# EAGLE design ATSAME51G19A_CAN_BREAKOUT (EAGLE 7.6.0)
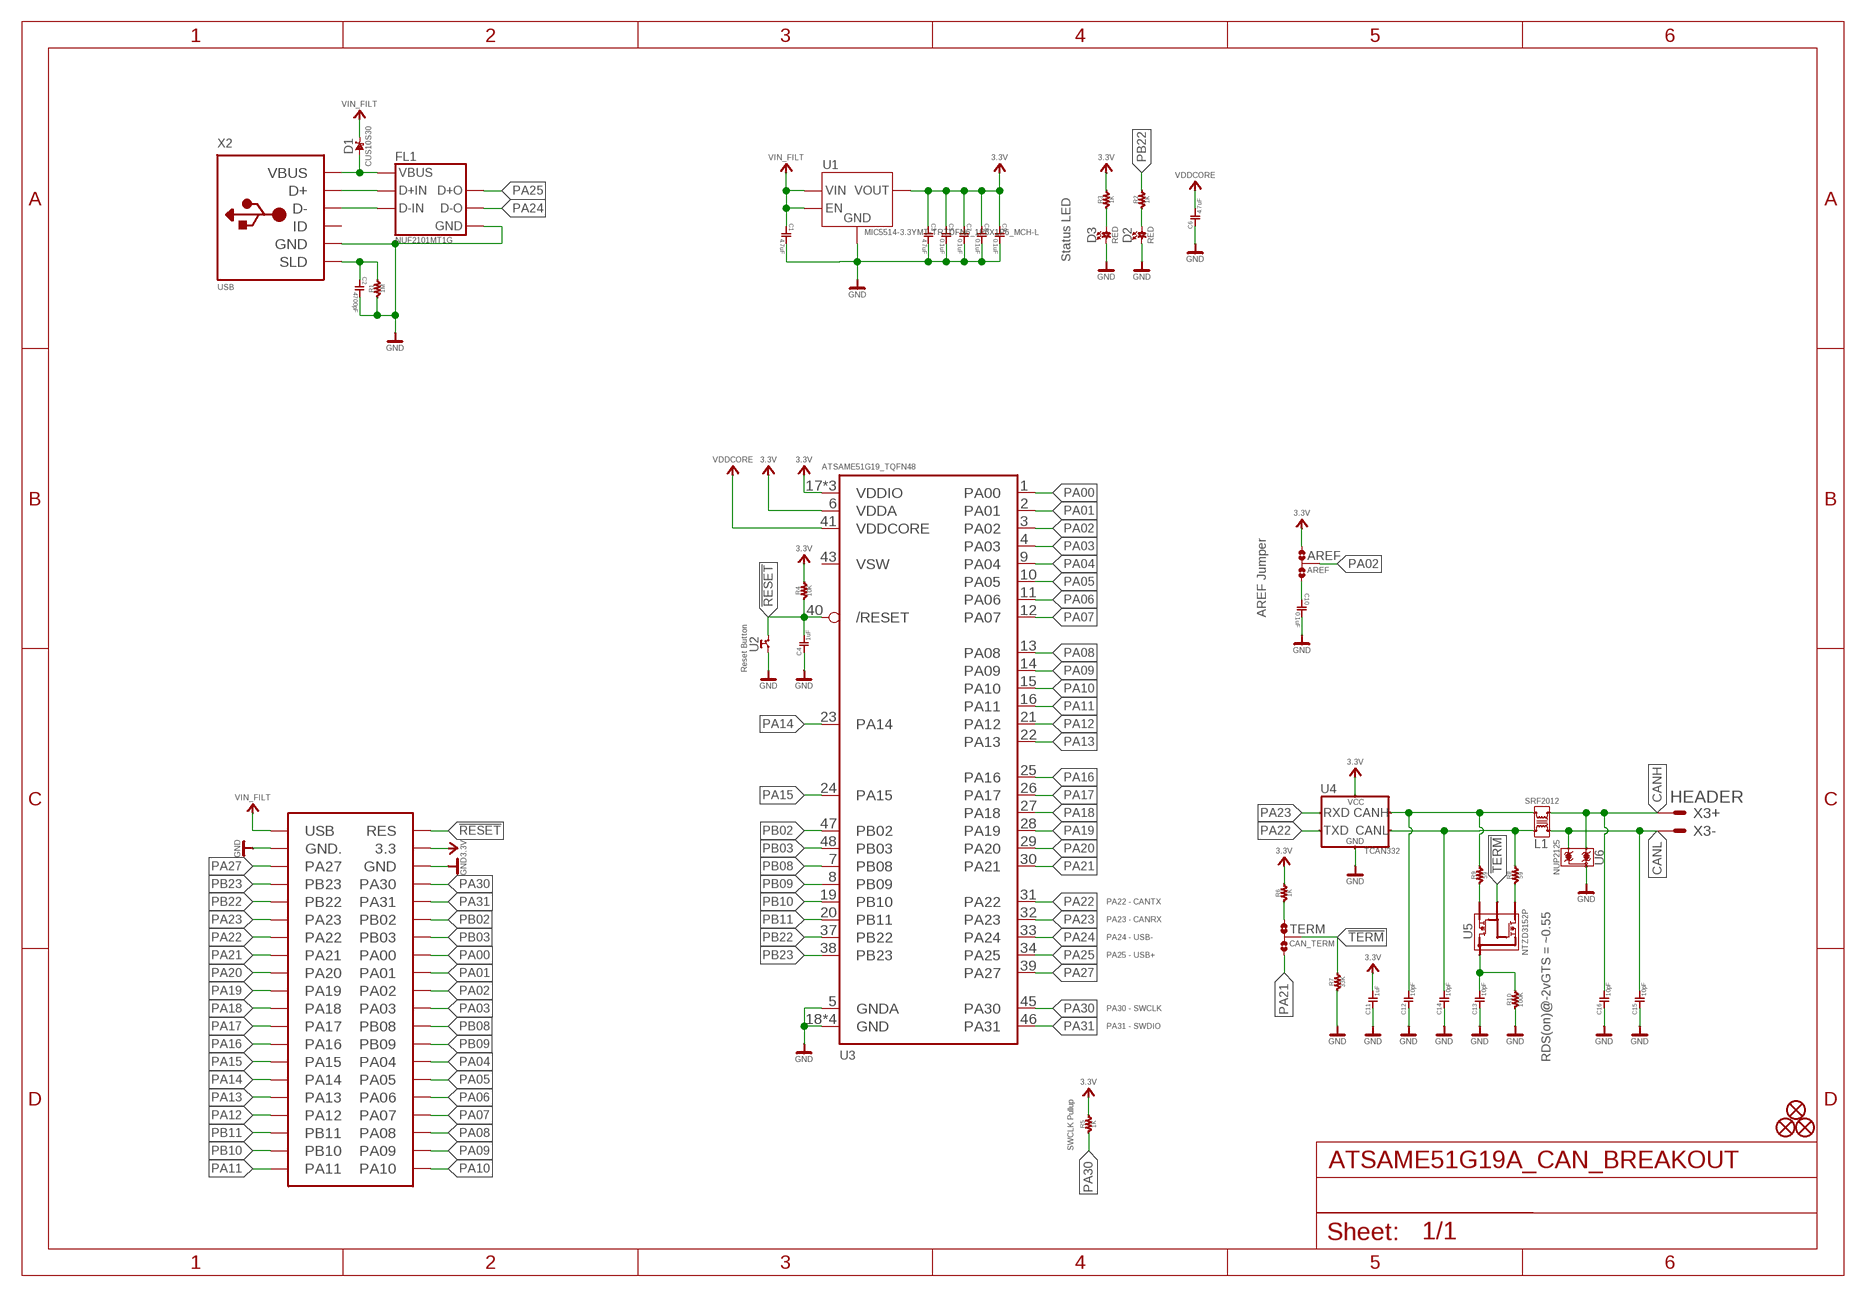
[diagram p0: schematic, sheet 1, part 1 of 2]
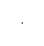
[diagram p1: schematic, sheet 1, part 2 of 2]

## Parts
AREF  AREF  0R-JUMPC  [C0R-JMP]
C1  4.7uF  CAPACITOR0402  [CAP0402]
C2  4700pF  CAPACITOR0402  [CAP0402]
C3  4.7uF  CAPACITOR0402  [CAP0402]
C4  1uF  CAPACITOR0402  [CAP0402]
C5  0.1uF  CAPACITOR0402  [CAP0402]
C6  4.7uF  CAPACITOR0402  [CAP0402]
C7  0.1uF  CAPACITOR0402  [CAP0402]
C8  0.1uF  CAPACITOR0402  [CAP0402]
C9  0.1uF  CAPACITOR0402  [CAP0402]
C10  0.1uF  CAPACITOR0402  [CAP0402]
C11  1uF  CAPACITOR0402  [CAP0402]
C12  10pF  CAPACITOR0402  [CAP0402]
C13  10pF  CAPACITOR0402  [CAP0402]
C14  10pF  CAPACITOR0402  [CAP0402]
C15  10pF  CAPACITOR0402  [CAP0402]
C16  10pF  CAPACITOR0402  [CAP0402]
D1  CUS10S30  SCHOTTKYX3-WLB1608-2  [X3-WLB1608-2]
D2  0603 LED  LED-SMD0603  [LED-0603]
D3  0603 LED  LED-SMD0603  [LED-0603]
FID1  MICROBUILDER_FIDUCIAL_0.5MM  [MICROBUILDER_FIDUCIAL_0.5MM]
FID2  MICROBUILDER_FIDUCIAL_0.5MM  [MICROBUILDER_FIDUCIAL_0.5MM]
FID3  MICROBUILDER_FIDUCIAL_0.5MM  [MICROBUILDER_FIDUCIAL_0.5MM]
FL1  NUF2101MT1G  [SOT95P275X110-6N]
L1  SRF2012  SRF2012AA  [SRF2012AA]
R1  1M  RESISTOR0402  [RES0402]
R2  1K  RESISTOR0402  [RES0402]
R3  1K  RESISTOR0402  [RES0402]
R4  10K  RESISTOR0402  [RES0402]
R5  1K  RESISTOR0402  [RES0402]
R6  1K  RESISTOR0402  [RES0402]
R7  33K  RESISTOR0402  [RES0402]
R8  59  RESISTOR0603  [RES0603]
R9  59  RESISTOR0603  [RES0603]
R10  100K  RESISTOR0402  [RES0402]
TERM  CAN_TERM  0R-JUMPC  [C0R-JMP]
U1  MIC5514-3.3YMT-TRTDFN6_1P6X1P6_MCH-L  [TDFN6_1P6X1P6_MCH-L]
U2  PUSH_SWITCHPTS815  [SWITCH_PTS815]
U3  ATSAME51G19_TQFN48  [TQFN48_7MM]
U4  TCAN332  [DCN0008A]
U5  NTZD3152P  PMOS_ARRAY_CANTNTZD3152P  [SOT-563]
U6  NUP2125  [SC70]
X1  CONN  SAME-BOARD  [BOARDOUTLINE]
X2  USB  [10118194]
X3  HEADER  22-23-2021  [22-23-2021]

## Nets
3.3V: AREF.1 C3.1(C1) C5.1(C1) C7.1(C1) C8.1(C1) C9.1(C1) C11.2(C2) R3.2 R4.2 R5.2 R6.2 U1.4(VOUT) U1.5(VOUT) U3.6(VDDA) U3.17(VDDIO) U3.36(VDDIO) U3.44(VDDIO) U4.3(VCC) X1.3.3
!RESET: C4.2(C2) R4.1 U2.P$3 U2.P$4 U3.40(/RESET) X1.!RES(RES)
!TERM: R7.2 TERM.2 U5.P$2(GATE) U5.P$5(GATE)
CANH: C16.2(C2) L1.4 U6.1 X3.1
CANL: C15.2(C2) L1.1 U6.2 X3.2
GND: C1.2(C2) C2.2(C2) C3.2(C2) C4.1(C1) C5.2(C2) C6.1(C1) C7.2(C2) C8.2(C2) C9.2(C2) C10.2(C2) C11.1(C1) C12.1(C1) C13.1(C1) C14.1(C1) C15.1(C1) C16.1(C1) D2.C D3.C FL1.2(GND) R1.1 R7.1 R10.1 U1.6(GND) U1.7(GND) U2.P$1 U2.P$2 U3.5(GNDA) U3.18(GND) U3.35(GND) U3.42(GND) U3.THERMAL(GND) U4.2(GND) U6.3 X1.GND X1.GND. X2.5(GND)
N$1: C13.2(C2) R10.2 U5.P$4(DRAIN1) U5.P$6(DRAIN1)
N$2: R8.1 U5.P$3(DRAIN2)
N$3: D3.A R3.1
N$4: FL1.6(D+I) X2.3(D+)
N$5: D2.A R2.1
N$6: FL1.4(D-_I) X2.2(D-)
N$7: R6.1 TERM.1
N$8: C2.1(C1) R1.2 X2.GND4(SLD) X2.GND5(SLD) X2.P$1(SLD) X2.P$2(SLD) X2.P$3(SLD) X2.P$4(SLD)
N$9: AREF.3 C10.1(C1)
N$18: C14.2(C2) L1.2 R8.2 U4.6(CANL)
N$21: R9.1 U5.P$1(SOURCE1)
N$23: C12.2(C2) L1.3 R9.2 U4.7(CANH)
PA00: U3.1(PA00) X1.PA00
PA01: U3.2(PA01) X1.PA01
PA02: AREF.2 U3.3(PA02) X1.PA02
PA03: U3.4(PA03) X1.PA03
PA04: U3.9(PA04) X1.PA04
PA05: U3.10(PA05) X1.PA05
PA06: U3.11(PA06) X1.PA06
PA07: U3.12(PA07) X1.PA07
PA08: U3.13(PA08) X1.PA08
PA09: U3.14(PA09) X1.PA09
PA10: U3.15(PA10) X1.PA10
PA11: U3.16(PA11) X1.PA11
PA12: U3.21(PA12) X1.PA12
PA13: U3.22(PA13) X1.PA13
PA14: U3.23(PA14) X1.PA14
PA15: U3.24(PA15) X1.PA15
PA16: U3.25(PA16) X1.PA16
PA17: U3.26(PA17) X1.PA17
PA18: U3.27(PA18) X1.PA18
PA19: U3.28(PA19) X1.PA19
PA20: U3.29(PA20) X1.PA20
PA21: TERM.3 U3.30(PA21) X1.PA21
PA22: U3.31(PA22) U4.1(TXD) X1.PA22
PA23: U3.32(PA23) U4.4(RXD) X1.PA23
PA24 [can]: FL1.3(D-_O) U3.33(PA24)
PA25 [can]: FL1.1(D+_O) U3.34(PA25)
PA27: U3.39(PA27) X1.PA27
PA30: R5.1 U3.45(PA30) X1.PA30
PA31: U3.46(PA31) X1.PA31
PB02: U3.47(PB02) X1.PB02
PB03: U3.48(PB03) X1.PB03
PB08: U3.7(PB08) X1.PB08
PB09: U3.8(PB09) X1.PB09
PB10: U3.19(PB10) X1.PB10
PB11: U3.20(PB11) X1.PB11
PB22: R2.2 U3.37(PB22) X1.PB22
PB23: U3.38(PB23) X1.PB23
VBUS: D1.ANNODE FL1.5(VBUS) X2.1(VBUS)
VDDCORE: C6.2(C2) U3.41(VDDCORE)
VIN_FILT: C1.1(C1) D1.CATHODE U1.1(EN) U1.2(EN) U1.3(VIN) X1.USB
Unconnected: U3.43(VSW) X2.4(ID)

## Notes on the sheet
- Status LED
- AREF Jumper
- Reset Button
- PA22 - CANTX
- PA23 - CANRX
- PA24 - USB-
- PA25 - USB+
- PA30 - SWCLK
- PA31 - SWDIO
- RDS(on)@-2vGTS = ~0.55
- SWCLK Pullup

## Library data of the parts
AREF TERM = MyLibrary:0R-JUMP: SMD 0R 0805 Jumper
C1 = MyLibrary:CAPACITOR: Ceramic Capacitors; MPN: CL05A106MP8NUB8; VOLTAGE: 10V
C2 = MyLibrary:CAPACITOR: Ceramic Capacitors; MPN: CC0402KRX7R8BB472; VOLTAGE: 25V
C3 C6 = MyLibrary:CAPACITOR: Ceramic Capacitors; MPN: GRM155R60J106ME05D; VOLTAGE: 6.3V
C4 C5 C7-C11 = MyLibrary:CAPACITOR: Ceramic Capacitors; MPN: CL05A105KQ5NNNC; VOLTAGE: 6.3V
C12-C16 = MyLibrary:CAPACITOR: Ceramic Capacitors; MPN: C0402C100K5RAC7867; VOLTAGE: 50V
D1 = MyLibrary:SCHOTTKY; MPN: SDM2U30CSP-7
D2 D3 = MyLibrary:LED-SMD: Red SMD LED Used in manufacturing of most products at SparkFun Packages: 0603 - SMD 0603 package [Product Link] <http://docs.avagotech.com/docs/AV02-0551EN> 0603 SMART - SMD 0603 SMART package ( more efficient and expensive)[Product Link] <http://www.osram-os.com/Graphics/XPic2/00077099_0.pdf> 1206 - SMD1206 package [Product Link] <https://www.sparkfun.com/datasheets/DevTools/LilyPad/Q150OVS4.pdff> SparkFun Products: Pro Mini 328 -5V <https://www.sparkfun.com/products/821> RedBoard <https://www.sparkfun.com/products/12757> IOIO-OTG <https://www.sparkfun.com/products/13613>; COLOR: RED; MPN: LNJ8W0C83RA
FID1-FID3 = Adafruit ItsyBitsy M4:MICROBUILDER_FIDUCIAL: Fiducial Alignment Points Various fiducial points for machine vision alignment.
FL1 = NUF2101MT1G:NUF2101MT1G: ON Semiconductor ESD Protection Diode 3.1mm Length,, 5.25 V, 225 mW Source: Datasheet <https://componentsearchengine.com/Datasheets/2/NUF2101MT1G.pdf>; ARROW_PART_NUMBER: NUF2101MT1G; ARROW_PRICE-STOCK: https://www.arrow.com/en/products/nuf2101mt1g/on-semiconductor; DESCRIPTION: ON Semiconductor ESD Protection Diode 3.1mm Length,, 5.25 V, 225 mW; HEIGHT: 1.1mm; MANUFACTURER_NAME: ON Semiconductor; MANUFACTURER_PART_NUMBER: NUF2101MT1G; MOUSER_PART_NUMBER: 863-NUF2101MT1G; MOUSER_PRICE-STOCK: https://www.mouser.co.uk/ProductDetail/ON-Semiconductor/NUF2101MT1G?qs=ZXBb0xZ9WeCMS4KEHrDDVQ%3D%3D
L1 = MyLibrary:SRF2012AA; MPN: SRF2012-121YA
R1 = MyLibrary:RESISTOR; MPN: PFR05S-105-FNH; TOLERANCE: 1%; WATTAGE: 1/16W
R2-R4 = MyLibrary:RESISTOR; MPN: CR0402-FX-1002GLF; TOLERANCE: 1%; WATTAGE: 1/16W
R5 R6 = MyLibrary:RESISTOR; MPN: PFR05S-102-FNH; TOLERANCE: 1%; WATTAGE: 1/16W
R7 = MyLibrary:RESISTOR; MPN: RMCF0402FT33K0; TOLERANCE: 1%; WATTAGE: 1/16W
R8 R9 = MyLibrary:RESISTOR; MPN: CRCW060359R0FKEAHP; TOLERANCE: 1%; WATTAGE: 1/3W
R10 = MyLibrary:RESISTOR; MPN: CR0402-FX-1003GLF; TOLERANCE: 1%; WATTAGE: 1/16W
U1 = MyLibrary:MIC5514-3.3YMT-TR; BUILT_BY: EMA_Jessica; COPYRIGHT: Copyright (C) 2018 Accelerated Designs. All rights reserved; MANUFACTURER_PART_NUMBER: MIC5514-3.3YMT-TR; SOURCELIBRARY: Microchip_2019-08-23_18; VENDOR: Microchip
U2 = MyLibrary:PUSH_SWITCH; MPN: PTS815 SJM 250 SMTR LFS
U3 = MyLibrary:ATSAME51G19; MPN: ATSAME51G19A-MF
U4 = MyLibrary:TCAN332; MPN: TCAN332DCNR
U5 = MyLibrary:PMOS_ARRAY_CANT; MPN: NTZD3152PT1G
U6 = MyLibrary:NUP2125; MPN: NUP2125WTT1G
X1 = MyLibrary:SAME-BOARD
X2 = MyLibrary:USB; MPN: 10118194-0001LF
X3 = con-molex:22-23-2021: .100" (2.54mm) Center Header - 2 Pin; MF: MOLEX; MPN: 22-23-2021; OC_FARNELL: 1462926; OC_NEWARK: 25C3832

## Net classes
0 default: width 0.152 mm, drill 0.254 mm, clearance 0.152 mm
1 can: width 0.152 mm, drill 0.254 mm, clearance 0.152 mm

## Board
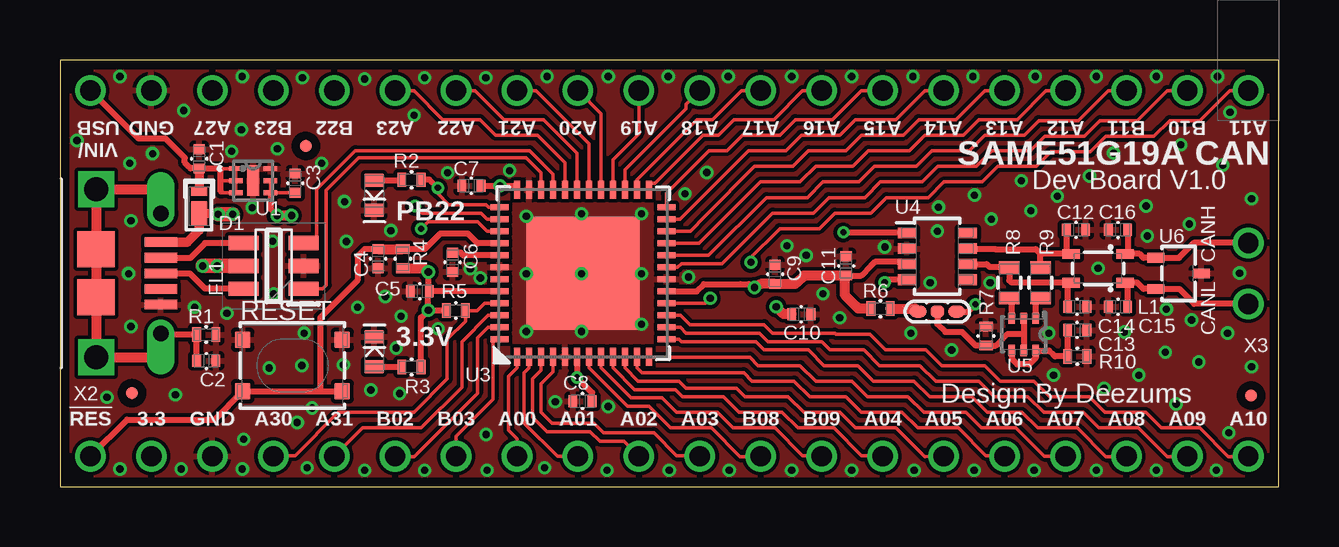
[diagram p2: board, top side]
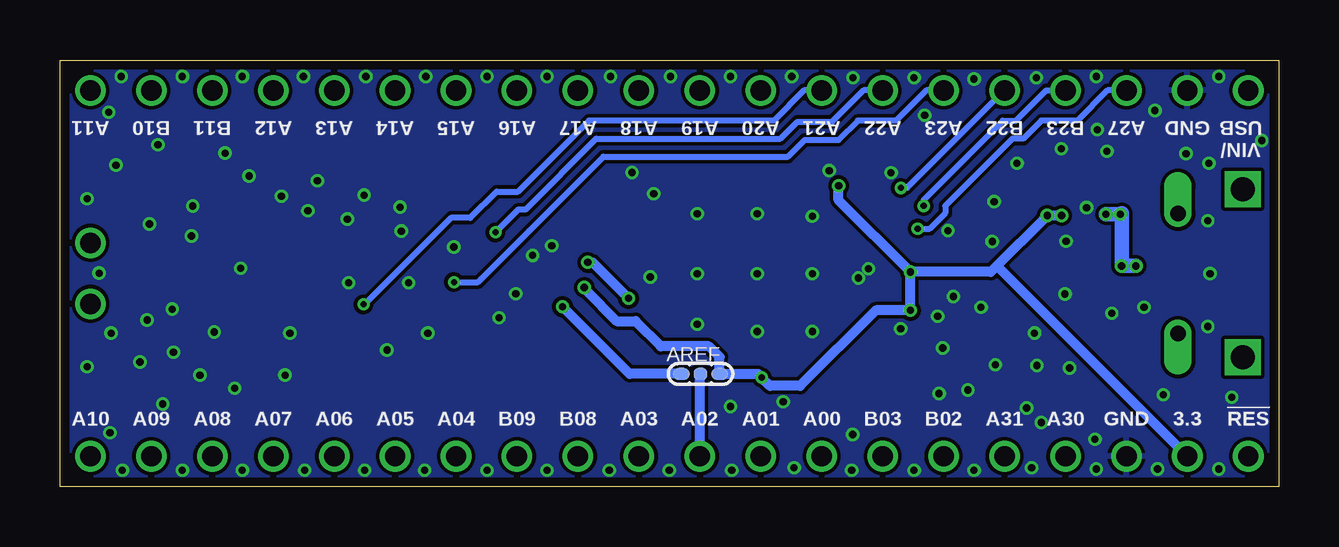
[diagram p3: board, bottom side, seen from below]

Size 50.8 x 17.78 mm. Coordinates in mm from the lower left corner, seen from the top.
Copper layers (1*16): Top 0.035559375mm / dielectric 1.6mm / Bottom 0.035559375mm
Design rules "oshpark-2layer *": minimum track width 6mil, minimum drill 10mil, track to track 6mil, track to pad 6mil, pad to pad 6mil, via to via 6mil, smd to smd 6mil, copper to edge 15mil, drill to drill 6mil, minimum pad ring 5mil, minimum via ring 5mil, stop-mask expansion 0.01mm, vias tented up to drill 0.3mm, thermal gap 6mil

### Footprints (pad centres in the part's own frame; a part is rotated, then mirrored left to right if it is on the bottom)
C0R-JMP = smd 0.5 x 0.7: 1 0,0.8; 3 0,-0.8 | smd 0.5 x 0.559: 2 0,0
CAP0402 = smd 0.4 x 0.5: 1 -0.4,0; 2 0.4,0
X3-WLB1608-2 = smd 1.035 x 0.69: ANNODE 0.293,0 | smd 0.385 x 0.69: CATHODE -0.619,0
LED-0603 = smd 0.55 x 0.8: A -0.625,0; C 0.625,0
MICROBUILDER_FIDUCIAL_0.5MM = smd 0.5 x 0.5: 1 0,0
SOT95P275X110-6N = smd 1.25 x 0.6: 1 -1.25,0.95; 2 -1.25,0; 3 -1.25,-0.95; 4 1.25,-0.95; 5 1.25,0; 6 1.25,0.95
SRF2012AA = smd 0.75 x 0.4: 1 -1.125,0.6; 2 1.125,0.6; 3 1.125,-0.6; 4 -1.125,-0.6
RES0402 = smd 0.4 x 0.6: 1 -0.4,0; 2 0.4,0
RES0603 = smd 0.5 x 0.9: 1 -0.65,0; 2 0.65,0
TDFN6_1P6X1P6_MCH-L = smd 0.559 x 0.203: 1 -0.724,0.508; 2 -0.724,0; 3 -0.724,-0.508; 4 0.724,-0.508; 5 0.724,0; 6 0.724,0.508 | smd 0.508 x 1.27: 7 0,0
SWITCH_PTS815 = smd 0.65 x 0.7: P$1 -2.075,1.075; P$2 2.075,1.075; P$3 -2.075,-1.075; P$4 2.075,-1.075
TQFN48_7MM = smd 0.25 x 0.75: 1 -2.75,-3.475; 2 -2.25,-3.475; 3 -1.75,-3.475; 4 -1.25,-3.475; 5 -0.75,-3.475; 6 -0.25,-3.475; 7 0.25,-3.475; 8 0.75,-3.475; 9 1.25,-3.475; 10 1.75,-3.475; 11 2.25,-3.475; 12 2.75,-3.475; 25 2.75,3.475; 26 2.25,3.475; 27 1.75,3.475; 28 1.25,3.475; 29 0.75,3.475; 30 0.25,3.475; 31 -0.25,3.475; 32 -0.75,3.475; 33 -1.25,3.475; 34 -1.75,3.475; 35 -2.25,3.475; 36 -2.75,3.475 | smd 0.75 x 0.25: 13 3.475,-2.75; 14 3.475,-2.25; 15 3.475,-1.75; 16 3.475,-1.25; 17 3.475,-0.75; 18 3.475,-0.25; 19 3.475,0.25; 20 3.475,0.75; 21 3.475,1.25; 22 3.475,1.75; 23 3.475,2.25; 24 3.475,2.75; 37 -3.475,2.75; 38 -3.475,2.25; 39 -3.475,1.75; 40 -3.475,1.25; 41 -3.475,0.75; 42 -3.475,0.25; 43 -3.475,-0.25; 44 -3.475,-0.75; 45 -3.475,-1.25; 46 -3.475,-1.75; 47 -3.475,-2.25; 48 -3.475,-2.75 | smd 4.7 x 4.7: THERMAL 0,0
DCN0008A = smd 0.8 x 0.45: 1 -1.275,0.975; 2 -1.275,0.325; 3 -1.275,-0.325; 4 -1.275,-0.975; 5 1.275,-0.975; 6 1.275,-0.325; 7 1.275,0.325; 8 1.275,0.975
SOT-563 = smd 0.3 x 0.45: P$1 -0.5,-0.675; P$2 0,-0.675; P$3 0.5,-0.675; P$4 0.5,0.675; P$5 0,0.675; P$6 -0.5,0.675
SC70 = smd 0.4 x 0.75: 1 0.65,0.95; 2 -0.65,0.95; 3 0,-0.95
BOARDOUTLINE = drill 0.85 pad 1.2: 3.3 3.81,1.27; !RES 1.27,1.27; GND 6.35,1.27; GND. 3.81,16.51; PA00 19.05,1.27; PA01 21.59,1.27; PA02 24.13,1.27; PA03 26.67,1.27; PA04 34.29,1.27; PA05 36.83,1.27; PA06 39.37,1.27; PA07 41.91,1.27; PA08 44.45,1.27; PA09 46.99,1.27; PA10 49.53,1.27; PA11 49.53,16.51; PA12 41.91,16.51; PA13 39.37,16.51; PA14 36.83,16.51; PA15 34.29,16.51; PA16 31.75,16.51; PA17 29.21,16.51; PA18 26.67,16.51; PA19 24.13,16.51; PA20 21.59,16.51; PA21 19.05,16.51; PA22 16.51,16.51; PA23 13.97,16.51; PA27 6.35,16.51; PA30 8.89,1.27; PA31 11.43,1.27; PB02 13.97,1.27; PB03 16.51,1.27; PB08 29.21,1.27; PB09 31.75,1.27; PB10 46.99,16.51; PB11 44.45,16.51; PB22 11.43,16.51; PB23 8.89,16.51; USB 1.27,16.51
10118194 = smd 1.35 x 0.4: 1 0,1.3; 2 0,0.65; 3 0,0; 4 0,-0.65; 5 0,-1.3 | smd 1.55 x 1.5: GND4 -2.7,1; GND5 -2.7,-1 | drill 1 pad 1.5 square: P$1 -2.7,3.5; P$2 -2.7,-3.5 | drill 0.65 pad 1.15 offset: P$3 0,2.5; P$4 0,-2.5
22-23-2021 = drill 0.85 pad 1.2: 1 -1.27,0; 2 1.27,0

### Placement (x,y rotation side)
AREF  24.1,4.7 270 bottom
C1  5.8,13.66 90 top
C2  6.1,5.24 0 top
C3  9.81,12.65 90 top
C4  13.26,9.5 90 top
C5  15,8.14 180 top
C6  16.36,9.35 90 top
C7  17.15,12.54 180 top
C8  21.78,3.57 180 top
C9  29.81,8.85 90 top
C10  30.9,7.19 0 top
C11  32.77,9.2 270 top
C12  42.35,10.7 180 top
C13  42.4,6.53 180 top
C14  42.4,7.5 180 top
C15  44.1,7.5 0 top
C16  44.1,10.7 0 top
D1  5.8,11.69 270 top
D2  13.1,12.15 270 top
D3  13.1,5.63 90 top
FID1  3,3.9 0 top
FID2  10.25,14.2 0 top
FID3  49.65,3.8 0 top
FL1  8.9,9.2 180 top
L1  43.27,9.1 180 top
R1  6.1,6.34 180 top
R2  14.65,12.79 0 top
R3  14.65,4.99 0 top
R4  14.29,9.5 270 top
R5  16.5,7.34 180 top
R6  34.2,7.42 180 top
R7  38.6,6.28 270 top
R8  39.57,8.5 90 top
R9  40.87,8.5 90 top
R10  42.4,5.43 180 top
TERM  36.57,7.3 90 top
U1  8.05,12.75 0 top
U2  9.69,5.05 0 top
U3  21.8,8.89 0 top
U4  36.57,9.6 0 top
U5  40.17,6.35 180 top
U6  46.62,8.89 90 top
X1  0,0 0 top
X2  4.2,8.89 0 top
X3  49.53,8.89 270 top

### Tracks (layer width: path | path; a pad name or v marks a point on that pad's centre or on a via)
3.3V  (via drill 0.25, 0.3)
  Top 0.152: U1.5 U1.4 C3.1
  Top 0.254: U3.17 26.54,8.14 26.84,8.44 28.35,8.44 28.71,8.44 v28.95,8.3 | U3.44 C5.1 15.35,8.19 v15.35,8.95 | C7.1 v18.34,12.54 19.05,12.54 U3.36 | v15.35,7.35 15.35,8.05 | R5.2 v15.34,7.34 v15.35,7.35 | U3.6 v21.55,4.55 22.18,3.92 C8.1 | C11.2 33.4,8.8 33.8,9.2 33.97,9.37 35,9.37 35.02,9.28 U4.3 | U1.4 8.77,11.58 v9.05,11.3 | 15.4,7.3 v15.35,7.35 | R3.2 15.05,7.05 v15.35,7.35
  Top 0.406: R4.2 15.2,9.1 v15.35,8.95 | v28.95,8.3 29.2,8.45 C9.1 30.65,8.45 30.7,8.5 31,8.8 32.7,8.8 | C11.2 32.7,8.8 | 32.7,8.8 32.7,8 33.2,7.5 33.28,7.42 R6.2 | v9.65,11.3 v9.05,11.3
  Bottom 0.406: v15.35,8.95 v15.35,7.35 16.8,7.35 19.95,4.2 21.2,4.2 v21.55,4.55 21.7,4.7 AREF.1 23.3,5.4 23.32,5.42 23.75,5.85 25.75,5.85 26.8,6.9 27.6,6.9 28.9,8.2 v28.95,8.3 | v15.35,8.95 18.34,11.94 v18.34,12.54 | 11.75,9.2 9.8,11.15 v9.65,11.3 v9.05,11.3 | 11.75,9.2 12,8.95 v15.35,8.95 | X1.3.3 11.74,9.2 11.75,9.2
!RESET
  Top 0.254: U3.40 17.41,10.14 17,10.55 15.85,10.55 15.2,9.9 R4.1 | X1.!RES 2.8,2.8 6.44,2.8 U2.P$3 10.85,3.98 | 10.85,3.98 U2.P$4 | C4.2 12.7,9.9 12.4,9.6 12.4,8.6 10.85,7.05 10.85,3.98
  Top 0.406: C4.2 R4.1
!TERM
  Top 0.254: U5.P$2 40.17,6.35 | 40.17,6.35 U5.P$5 | 40.17,6.35 39.47,6.35 39,5.88 R7.2 38.17,5.88 37.6,6.45 36.9,6.45 36.57,6.78 TERM.2
CANH
  Top 0.254: X3.1 47.26,10.16 47.2,10.1 46.64,9.54 U6.1 45.16,9.54 45,9.7 L1.4 44.5,9.7 C16.2
CANL
  Top 0.254: X3.2 47.28,7.62 47.2,7.7 46.66,8.24 U6.2 45.16,8.24 44.9,8.5 L1.1 44.5,8.5 C15.2
GND  (via drill 0.3)
  other vias: 36.27,8.5 36.57,10.65 17.75,17.04 17.1,9.08 20.2,0.79 22.8,0.69 25.4,0.69 27.9,0.69 30.5,0.69 17.8,0.69 15.2,0.69 12.7,0.69 10.3,0.79 33,0.69 35.6,0.69 38.1,0.69 40.6,0.69 43.2,0.69 45.7,0.69 48.2,0.69 22.85,17.09 25.35,17.09 27.85,17.09 30.5,17.09 33,17.09 35.55,17.09 38.05,17.09 40.65,17.09 43.2,17.09 45.7,17.09 20.3,17.09 15.2,17.04 12.7,16.99 10.1,17.04 7.6,17.09 2.5,17.09 48.25,17.09 7.6,0.74 5.05,0.74 2.5,0.74 26.05,12.21 26.96,13.09 26.2,8.74 31.1,9.64 20.65,3.54 17.52,8.7 14.76,15.48 18.74,13.17 22.85,3.34 35.47,6.4 41.22,6.4 44.97,4.65 41.42,4.65 43.52,4.1 46.52,3.45 48.72,2.25 36.62,11.65 38.12,12.15 40.07,12.75 43.92,13.9 48.77,15.6 46.72,14.25 49.17,8.9 40.47,11.5 30.3,10.04 46.12,7.4 47.17,6.95 48.67,6.4 46.07,5.6 47.47,5.2 49.67,12 47.07,10.95 45.27,11.7 43.27,9.1 41.57,12.1 42.92,12.95 48.47,13.4 16.16,13.08 11.94,10.22 8.01,11.63 13.56,7.93 12.41,7.48 11.81,5.08 12.96,4.03 14.16,3.88 17.76,2.18 2.96,11.08 2.96,6.68 9.89,2.68 5.16,15.68 7.66,1.98 4.81,3.83 8.86,10.23 1.96,3.73 10.08,5.05 14.22,7.1 10.51,3.28 8.72,4.95 2.86,8.88 3.86,13.88 0.71,14.43 2.91,13.48 37.17,5.7 38.77,8.5 34.38,9.99 31.8,8.04 32.5,7.04 38.82,11.15 44.37,6.45 45.32,10.45 19.44,11.27 21.74,11.37 24.24,11.37 24.24,8.87 19.44,8.87 21.74,8.87 19.44,6.47 21.74,6.47 24.24,6.77 7.56,14.88 11.86,11.88 6.96,7.23 14.01,5.78 5.61,7.48 8.91,8.03 10.18,6.4 9.06,14.08 7.16,13.98 15.76,6.58 10.91,13.48 13.79,10.67 49.67,5
  pour Top (rank 6): 0,0 50.8,0 50.8,17.78 0,17.78
  pour Bottom (rank 6): 50.8,0 0,0 0,17.78 50.8,17.78
N$1
  Top 0.254: U5.P$4 39.67,5.33 39.9,5.1 40.4,5.1 40.67,5.37 U5.P$6 41.23,5.68 41.4,5.5 41.47,5.43 R10.2 C13.2
N$2
  Top 0.254: U5.P$3 39.67,7.85 R8.1
N$3
  Top 0.254: D3.A 13.12,4.99 R3.1
N$4
  Top 0.254: X2.3 5.41,8.89 6.05,8.25 FL1.6
N$5
  Top 0.254: D2.A 14.25,12.78 R2.1
N$6
  Top 0.254: X2.2 5.44,9.54 6.05,10.15 FL1.4
N$7
  Top 0.406: R6.1 35.65,7.42 TERM.1
N$8
  Top 0.254: X2.P$4 4.25,6.34 R1.2 C2.1
  Top 0.406: X2.P$4 4.2,5.39 X2.P$2 X2.GND5 X2.GND4 X2.P$1 4.2,12.39 X2.P$3
N$9  (via drill 0.3)
  Top 0.406: C10.1 30.16,7.19 v29.85,7.5
  Bottom 0.406: v29.84,7.5 v29.85,7.5 27.05,4.7 AREF.3
N$18
  Top 0.254: C14.2 42,8.5 L1.2 39.67,8.5 39.57,8.6 R8.2 38.75,9.15 38.62,9.28 U4.6
N$21
  Top 0.254: U5.P$1 40.67,7.85 R9.1
N$23
  Top 0.254: 40.87,9.7 L1.3 41.95,9.7 C12.2 | 40.87,9.7 40.67,9.9 38.97,9.9 37.87,9.9 U4.7 | R9.2 40.87,9.7
PA00
  Top 0.152: U3.1 19.05,4.95 18.7,4.6 18.7,2.35 19.05,2 X1.PA00
PA01
  Top 0.152: U3.2 19.55,4.95 19.35,4.75 19.35,2.65 20.73,1.27 X1.PA01
PA02
  Top 0.152: U3.3 20.05,4.85 19.7,4.5 19.7,2.9 20.3,2.3 22.1,2.3 22.5,1.9 23.5,1.9 X1.PA02
  Bottom 0.406: 24.12,1.43 X1.PA02 24.13,4.67 AREF.2
PA03
  Top 0.152: U3.4 20.55,4.8 20.05,4.3 20.05,3.1 20.5,2.65 22.25,2.65 22.65,2.25 24.75,2.25 25.7,1.3 26.74,1.3 X1.PA03
PA04
  Top 0.152: U3.9 23.05,4.95 23.95,4.05 25.65,4.05 25.95,3.75 27.65,3.75 28.3,3.1 30.1,3.1 30.75,2.45 32.25,2.45 33.4,1.3 34.26,1.3 X1.PA04
PA05
  Top 0.152: U3.10 23.55,4.95 24.1,4.4 25.8,4.4 26.1,4.1 28.2,4.1 28.4,3.9 28.55,3.75 30.35,3.75 31,3.1 32.5,3.1 33.15,2.45 34.85,2.45 36.05,1.25 X1.PA05
PA06
  Top 0.152: U3.11 24.05,4.95 24.25,4.75 28.5,4.75 28.85,4.4 30.6,4.4 31.25,3.75 32.75,3.75 33.4,3.1 35.1,3.1 35.75,2.45 37.45,2.45 38.6,1.3 39.24,1.3 X1.PA06
PA07
  Top 0.152: U3.12 28.75,5.4 29.1,5.05 30.85,5.05 31.5,4.4 33,4.4 33.65,3.75 35.35,3.75 36,3.1 37.75,3.1 38.4,2.45 39.85,2.45 41.03,1.27 X1.PA07
PA08
  Top 0.152: X1.PA08 44.43,1.25 43.6,1.25 42.4,2.45 40.75,2.45 40.1,3.1 38.65,3.1 38,3.75 36.25,3.75 35.6,4.4 33.9,4.4 33.25,5.05 31.85,5.05 31.2,5.7 29.35,5.7 29,6.05 25.9,6.05 25.81,6.14 U3.13
PA09
  Top 0.152: U3.14 25.76,6.64 25.86,6.64 26.1,6.4 29.15,6.4 29.5,6.05 31.75,6.05 32.1,5.7 33.5,5.7 34.15,5.05 35.85,5.05 36.5,4.4 38.3,4.4 38.95,3.75 40.35,3.75 41,3.1 42.65,3.1 43.3,2.45 44.95,2.45 46.15,1.25 46.97,1.25 X1.PA09
PA10
  Top 0.152: U3.15 25.76,7.14 25.86,7.14 26.25,6.75 29.35,6.75 29.7,6.4 32.3,6.4 32.35,6.35 33.75,6.35 34.4,5.7 36.1,5.7 36.75,5.05 38.55,5.05 39.2,4.4 40.6,4.4 41.25,3.75 42.9,3.75 43.55,3.1 45.25,3.1 45.9,2.45 47.5,2.45 48.7,1.25 49.51,1.25 X1.PA10
PA11  (via drill 0.3)
  Top 0.152: U3.16 26.91,7.64 v27.1,7.85 | v28.8,9.35 28.7,9.45 30,10.75 31.65,10.75 32.3,11.4 33.8,11.4 34.45,12.05 36.2,12.05 36.85,12.7 38.45,12.7 39.1,13.35 40.7,13.35 41.3,13.95 42.95,13.95 43.6,14.6 45.6,14.6 46.25,15.25 47.5,15.25 48.75,16.5 X1.PA11
  Bottom 0.406: v28.8,9.35 28.6,9.35 v27.1,7.85
PA12
  Top 0.152: U3.21 26.64,10.14 29.2,12.7 30.85,12.7 31.5,13.35 33.05,13.35 33.7,14 35.4,14 36.05,14.65 37.65,14.65 38.3,15.3 39.9,15.3 41.1,16.5 X1.PA12
PA13
  Top 0.152: U3.22 26.29,10.64 26.9,11.3 28.95,13.35 30.55,13.35 31.2,14 32.75,14 33.4,14.65 35.15,14.65 35.8,15.3 37.35,15.3 38.55,16.5 X1.PA13
PA14
  Top 0.152: U3.23 25.84,11.14 28.7,14 30.25,14 30.9,14.65 32.5,14.65 33.15,15.3 34.85,15.3 36.05,16.5 X1.PA14
PA15
  Top 0.152: X1.PA15 33.4,16.5 32.2,15.3 30.65,15.3 30,14.65 28.45,14.65 27.8,14 27.05,14 25.27,12.23 U3.24
PA16
  Top 0.152: X1.PA16 30.95,16.5 29.75,15.3 28.1,15.3 27.45,14.65 26.8,14.65 24.8,12.65 24.55,12.65 U3.25
PA17
  Top 0.152: U3.26 24.05,12.8 26.55,15.3 27.2,15.3 28.4,16.5 X1.PA17
  Top 0.254: X1.PA17
PA18
  Top 0.152: U3.27 23.55,13.2 26.1,15.75 26.1,15.94 X1.PA18
PA19
  Top 0.152: U3.28 23.05,13.63 24.13,14.71 X1.PA19
PA20
  Top 0.152: U3.29 22.55,15.55 X1.PA20
PA21  (via drill 0.25)
  Top 0.152: U3.30 22.05,14.3 19.85,16.5 X1.PA21
  Top 0.254: TERM.3 37.85,7.3 v38.15,7.6
  Bottom 0.254: X1.PA21 19.79,16.51 21.05,15.25 28.75,15.25 31.7,12.3 32.6,12.3 33.7,11.2 34.5,11.2 38.1,7.6 v38.15,7.6
PA22  (via drill 0.25)
  Top 0.152: U3.31 21.55,13.9 20.15,15.3 18.5,15.3 17.3,16.5 X1.PA22
  Top 0.254: U4.1 32.67,10.58 v32.65,10.6
  Bottom 0.254: v32.65,10.6 31.7,11.55 31.4,11.55 28.45,14.5 20.77,14.5 20.07,15.2 18.62,15.2 17.31,16.51 X1.PA22
PA23  (via drill 0.25)
  Top 0.152: U3.32 21.05,13.5 19.9,14.65 18.15,14.65 17.5,15.3 15.95,15.3 14.75,16.5 X1.PA23
  Top 0.254: U4.4 34.48,8.62 v34.38,8.53
  Bottom 0.254: X1.PA23 14.69,16.51 15.95,15.25 17.55,15.25 18.35,14.45 19.75,14.45 20.45,13.75 28.15,13.75 31.25,10.65 33.25,8.65 33.38,8.53 v34.38,8.53
PA24
  Top 0.152: U3.33 20.55,13.02 19.56,14 12.3,14 10.7,12.4 10.7,10.15 FL1.3
PA25
  Top 0.152: U3.34 20.05,13.08 19.44,13.7 12.45,13.7 11.1,12.35 11.1,8.4 10.95,8.25 FL1.1
PA27  (via drill 0.25)
  Top 0.152: U3.39 17.81,10.64 17.4,11.05 15.35,11.05 v15.05,10.75
  Bottom 0.254: v15.05,10.75 14.55,10.75 13.9,11.4 13.9,11.7 11.1,14.5 10.65,14.5 9.9,15.25 8.4,15.25 7.14,16.51 X1.PA27
PA30
  Top 0.152: U3.45 17.69,7.64 17.39,7.34 R5.1 16.9,6.9 16.14,6.14 16.14,4.49 14.75,3.1 11.6,3.1 9.8,1.3 8.92,1.3 X1.PA30 8.97,1.27
PA31
  Top 0.152: U3.46 17.84,7.14 16.75,6.05 16.75,4.15 15.05,2.45 12.61,2.45 X1.PA31
PB02
  Top 0.152: U3.47 17.84,6.64 17.4,6.2 17.4,3.9 14.75,1.25 13.99,1.25 X1.PB02
PB03
  Top 0.152: U3.48 18.05,6.14 18.05,3.65 16.5,2.1 X1.PB03
PB08
  Top 0.152: U3.7 22.05,4.95 23.65,3.35 24.55,3.35 25.45,2.45 27.15,2.45 28.35,1.25 29.23,1.25 X1.PB08
PB09
  Top 0.152: U3.8 22.55,4.95 23.8,3.7 25.1,3.7 25.7,3.1 27.4,3.1 28.05,2.45 29.8,2.45 30.95,1.3 31.72,1.3 X1.PB09
PB10
  Top 0.152: U3.19 25.74,9.14 25.9,9.3 27.6,9.3 29.7,11.4 31.4,11.4 32.05,12.05 33.55,12.05 34.2,12.7 35.95,12.7 36.6,13.35 38.2,13.35 38.85,14 40.45,14 41.05,14.6 42.7,14.6 43.35,15.25 44.9,15.25 46.15,16.5 X1.PB10
PB11
  Top 0.152: U3.20 27.04,9.64 29.45,12.05 31.15,12.05 31.8,12.7 33.3,12.7 33.95,13.35 35.7,13.35 36.35,14 37.9,14 38.55,14.65 40.2,14.65 40.8,15.25 42.45,15.25 43.7,16.5 X1.PB11
PB22  (via drill 0.25)
  Top 0.152: U3.37 17.86,11.64 17.75,11.75 16.2,11.75 15.75,12.2 v15.75,12.45
  Top 0.254: v15.75,12.45 15.4,12.8 R2.2
  Bottom 0.254: v15.75,12.45 15.49,12.45 X1.PB22
PB23  (via drill 0.25)
  Top 0.152: U3.38 17.81,11.14 17.55,11.4 15.1,11.4 v14.8,11.7
  Bottom 0.254: X1.PB23 9.69,16.51 10.95,15.25 11.5,15.25 14.8,11.95 v14.8,11.7
VBUS  (via drill 0.3)
  Top 0.375: D1.ANNODE 6.4,11.4 v6.6,11.35
  Top 0.4: X2.1 5.3,10.19 5.8,10.69 D1.ANNODE
  Top 0.6: FL1.5 v6.55,9.2 | v6.55,9.2 6.2,9.2 v6.55,9.2 | v6.55,9.2 v5.95,9.2 v6.55,9.2 | v7.2,11.35 v6.6,11.35
  Bottom 0.6: v5.95,9.2 v6.55,9.2 6.55,11.4 v6.6,11.35 v7.2,11.35
VDDCORE
  Top 0.254: C6.2 16.7,9.75 16.81,9.64 U3.41
VIN_FILT
  Top 0.152: U1.2 U1.1 6.71,13.26 6.7,13.2 | U1.2 U1.3 6.76,12.24 6.7,12.3 | U1.2 6.7,12.75
  Top 0.254: 6.7,13.2 6.7,12.75 6.7,12.3 | 6.71,13.26 C1.1 5.44,13.26 5.3,13.4 5.2,13.5 5.2,13.7 4.4,14.5 3.28,14.5 X1.USB
  Top 0.375: C1.1 D1.CATHODE

### Text on the board
tNames: SAME51G19A CAN | Dev Board V1.0 | PB22 | CANH | CANL | RESET | 3.3V | Design By Deezums
tDocu: 3.3V